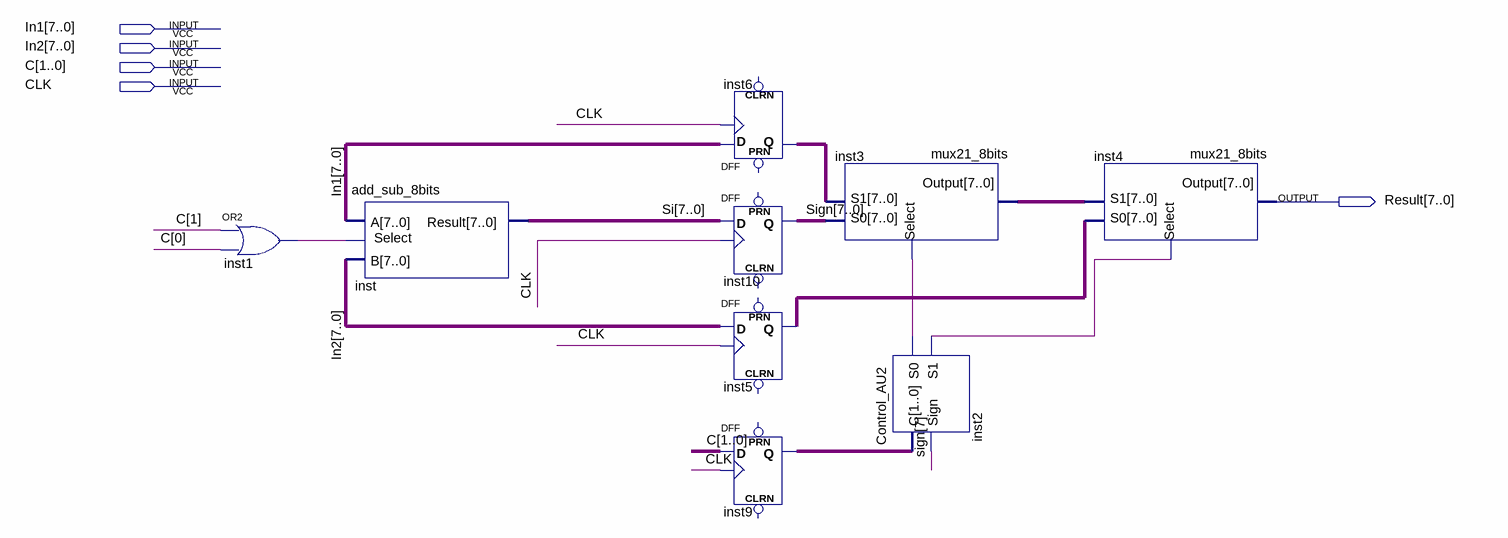
[diagram p0: schematic sheet]
// Quartus schematic AU2_2state.bdf as structural Verilog: 9 symbols, 5 pins
module AU2_2state (
  input  [7:0] In1,
  input  [7:0] In2,
  input  [1:0] C,
  input  CLK,
  output [7:0] Result
);

  wire inst1_out, inst2_s0, inst2_s1;
  wire [1:0] inst9_q;
  wire [7:0] inst3_output, inst5_q, inst6_q, Si, Sign;

  or inst1 (inst1_out, C[1], C[0]);
  add_sub_8bits inst (.Select(inst1_out), .A(In1), .B(In2), .Result(Si));
  DFF inst6[7:0] (.CLK(CLK), .D(In1), .Q(inst6_q));  // open: CLRN, PRN
  DFF inst10[7:0] (.CLK(CLK), .D(Si), .Q(Sign));  // open: CLRN, PRN
  DFF inst5[7:0] (.CLK(CLK), .D(In2), .Q(inst5_q));  // open: CLRN, PRN
  DFF inst9[1:0] (.CLK(CLK), .D(C), .Q(inst9_q));  // open: CLRN, PRN
  mux21_8bits inst3 (.S0(Sign), .S1(inst6_q), .Select(inst2_s0), .Output(inst3_output));
  Control_AU2 inst2 (.C(inst9_q), .Sign(Sign[7]), .S0(inst2_s0), .S1(inst2_s1));
  mux21_8bits inst4 (.S0(inst5_q), .S1(inst3_output), .Select(inst2_s1), .Output(Result));
endmodule
